# Altium schematic sheet DSP.SchDoc
size B; SheetNumber: 6; SheetTotal: 7
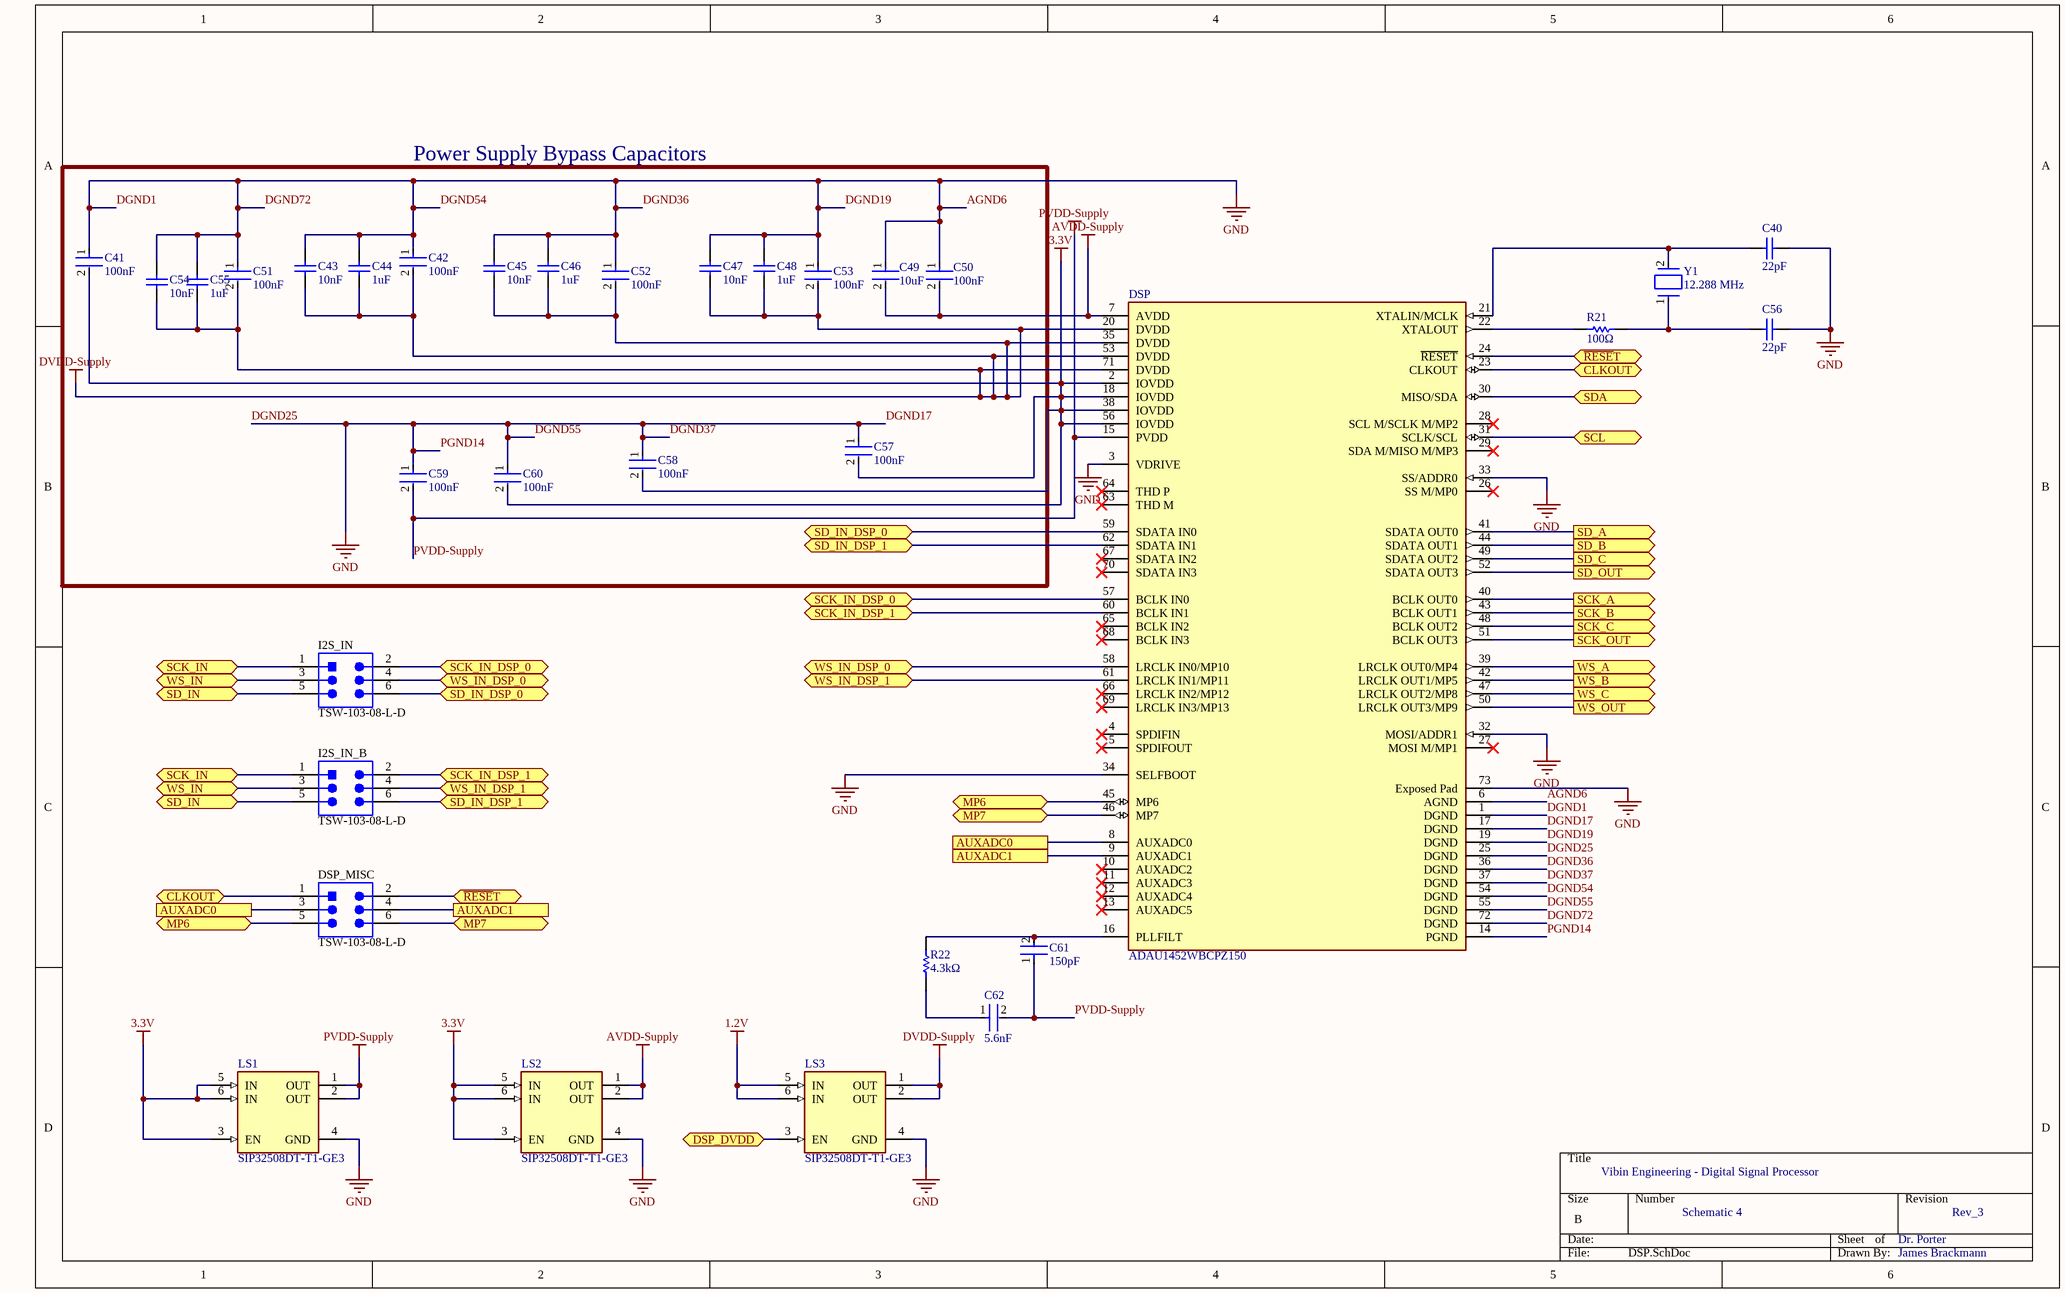
[diagram p0: DSP.SchDoc]

## Parts
C40  22pF  [CAPC1608X90X35ML10T15]
C41  100nF  [FP-C0402-BB-MFG]
C42  100nF  [FP-C0402-BB-MFG]
C43  10nF  [CAPC1005X56X25NL10T15]
C44  1uF  [CAPC2013X145X50LL20T25]
C45  10nF  [CAPC1005X56X25NL10T15]
C46  1uF  [CAPC2013X145X50LL20T25]
C47  10nF  [CAPC1005X56X25NL10T15]
C48  1uF  [CAPC2013X145X50LL20T25]
C49  10uF  [FP-GRM188-0_1-e0_2_0_55-IPC_A]
C50  100nF  [FP-C0402-BB-MFG]
C51  100nF  [FP-C0402-BB-MFG]
C52  100nF  [FP-C0402-BB-MFG]
C53  100nF  [FP-C0402-BB-MFG]
C54  10nF  [CAPC1005X56X25NL10T15]
C55  1uF  [CAPC2013X145X50LL20T25]
C56  22pF  [CAPC1608X90X35ML10T15]
C57  100nF  [FP-C0402-BB-MFG]
C58  100nF  [FP-C0402-BB-MFG]
C59  100nF  [FP-C0402-BB-MFG]
C60  100nF  [FP-C0402-BB-MFG]
C61  150pF  [FP-0805-L_2_01_0_2-W_1_25-IPC_B]
C62  5.6nF  [FP-CL10-IPC_A]
DSP  ADAU1452WBCPZ150  [FP-CP-72-6-IPC_B]
DSP_MISC  TSW-103-08-L-D  [SMTC-TSW-103-08-L-D_V]
I2S_IN  TSW-103-08-L-D  [SMTC-TSW-103-08-L-D_V]
I2S_IN_B  TSW-103-08-L-D  [SMTC-TSW-103-08-L-D_V]
LS1  SIP32508DT-T1-GE3  [FP-E13-1126-IPC_C]
LS2  SIP32508DT-T1-GE3  [FP-E13-1126-IPC_C]
LS3  SIP32508DT-T1-GE3  [FP-E13-1126-IPC_C]
R21  100Ω  [RESC2013X60X40ML20T25]
R22  4.3kΩ  [RESC1005X40X25ML05T10]
Y1  12.288 MHz  [FP-ABM3-MFG]

## Blocks framed on the sheet
Power Supply Bypass Capacitors: C41-C55 C57-C60

## Ports
AUXADC0, AUXADC1, CLKOUT (bidir), DSP_DVDD (bidir), MP6 (bidir), MP7 (bidir), SCK_A (out), SCK_B (out), SCK_C (out), SCK_IN (bidir), SCK_IN_DSP_0 (bidir), SCK_IN_DSP_1 (bidir), SCK_OUT (out), SCL (bidir), SD_A (out), SD_B (out), SD_C (out), SD_IN (bidir), SD_IN_DSP_0 (bidir), SD_IN_DSP_1 (bidir), SD_OUT (out), SDA (bidir), WS_A (out), WS_B (out), WS_C (out), WS_IN (bidir), WS_IN_DSP_0 (bidir), WS_IN_DSP_1 (bidir), WS_OUT (out), ~{RESE}T (bidir)

## Nets
1.2V: LS3.5(IN) LS3.6(IN)
3.3V: C41.2 C57.2 C58.2 C60.2 DSP.2(IOVDD) DSP.18(IOVDD) DSP.38(IOVDD) DSP.56(IOVDD) LS1.3(EN) LS1.5(IN) LS1.6(IN) LS2.3(EN) LS2.5(IN) LS2.6(IN)
AGND6: C40.2 C41.1 C42.1 C43.2 C44.2 C45.2 C46.2 C47.2 C48.2 C49.1 C50.1 C51.1 C52.1 C53.1 C54.2 C55.2 C56.2 C57.1 C58.1 C59.1 C60.1 DSP.1(DGND) DSP.3(VDRIVE) DSP.6(AGND) DSP.14(PGND) DSP.17(DGND) DSP.19(DGND) DSP.25(DGND) DSP.32(MOSI/ADDR1) DSP.33(SS/ADDR0) DSP.34(SELFBOOT) DSP.36(DGND) DSP.37(DGND) DSP.54(DGND) DSP.55(DGND) DSP.72(DGND) DSP.73(Exposed_Pad) LS1.4(GND) LS2.4(GND) LS3.4(GND)  [also labelled DGND1, DGND17, DGND19, DGND25, DGND36, DGND37, DGND54, DGND55, DGND72, GND, PGND14]
AVDD-Supply: C49.2 C50.2 DSP.7(AVDD) LS2.1(OUT) LS2.2(OUT)
DVDD-Supply: C42.2 C43.1 C44.1 C45.1 C46.1 C47.1 C48.1 C51.2 C52.2 C53.2 C54.1 C55.1 DSP.20(DVDD) DSP.35(DVDD) DSP.53(DVDD) DSP.71(DVDD) LS3.1(OUT) LS3.2(OUT)
PVDD-Supply: C59.2 C61.1 C62.2 DSP.15(PVDD) LS1.1(OUT) LS1.2(OUT)
~{RESE}T: DSP.24(~{RESET}) DSP_MISC.2 ; port ~{RESE}T
AUXADC0: DSP.8(AUXADC0) DSP_MISC.3 ; port AUXADC0
AUXADC1: DSP.9(AUXADC1) DSP_MISC.4 ; port AUXADC1
CLKOUT: DSP.23(CLKOUT) DSP_MISC.1 ; port CLKOUT
DSP_DVDD: LS3.3(EN) ; port DSP_DVDD
MP6: DSP.45(MP6) DSP_MISC.5 ; port MP6
MP7: DSP.46(MP7) DSP_MISC.6 ; port MP7
SCK_A: DSP.40(BCLK_OUT0) ; port SCK_A
SCK_B: DSP.43(BCLK_OUT1) ; port SCK_B
SCK_C: DSP.48(BCLK_OUT2) ; port SCK_C
SCK_IN: I2S_IN.1 I2S_IN_B.1 ; port SCK_IN
SCK_IN_DSP_0: DSP.57(BCLK_IN0) I2S_IN.2 ; port SCK_IN_DSP_0
SCK_IN_DSP_1: DSP.60(BCLK_IN1) I2S_IN_B.2 ; port SCK_IN_DSP_1
SCK_OUT: DSP.51(BCLK_OUT3) ; port SCK_OUT
SCL: DSP.31(SCLK/SCL) ; port SCL
SD_A: DSP.41(SDATA_OUT0) ; port SD_A
SD_B: DSP.44(SDATA_OUT1) ; port SD_B
SD_C: DSP.49(SDATA_OUT2) ; port SD_C
SD_IN: I2S_IN.5 I2S_IN_B.5 ; port SD_IN
SD_IN_DSP_0: DSP.59(SDATA_IN0) I2S_IN.6 ; port SD_IN_DSP_0
SD_IN_DSP_1: DSP.62(SDATA_IN1) I2S_IN_B.6 ; port SD_IN_DSP_1
SD_OUT: DSP.52(SDATA_OUT3) ; port SD_OUT
SDA: DSP.30(MISO/SDA) ; port SDA
WS_A: DSP.39(LRCLK_OUT0/MP4) ; port WS_A
WS_B: DSP.42(LRCLK_OUT1/MP5) ; port WS_B
WS_C: DSP.47(LRCLK_OUT2/MP8) ; port WS_C
WS_IN: I2S_IN.3 I2S_IN_B.3 ; port WS_IN
WS_IN_DSP_0: DSP.58(LRCLK_IN0/MP10) I2S_IN.4 ; port WS_IN_DSP_0
WS_IN_DSP_1: DSP.61(LRCLK_IN1/MP11) I2S_IN_B.4 ; port WS_IN_DSP_1
WS_OUT: DSP.50(LRCLK_OUT3/MP9) ; port WS_OUT
NetC40_1: C40.1 DSP.21(XTALIN/MCLK) Y1.2
NetC56_1: C56.1 R21.2 Y1.1
NetC61_2: C61.2 DSP.16(PLLFILT) R22.2
NetC62_1: C62.1 R22.1
NetDSP_22: DSP.22(XTALOUT) R21.1

Not connected (* = marked no-connect by the designer): DSP 4(SPDIFIN)* 5(SPDIFOUT)* 10(AUXADC2)* 11(AUXADC3)* 12(AUXADC4)* 13(AUXADC5)* 26(SS_M/MP0)* 27(MOSI_M/MP1)* 28(SCL_M/SCLK_M/MP2)* 29(SDA_M/MISO_M/MP3)* 63(THD_M)* 64(THD_P)* 65(BCLK_IN2)* 66(LRCLK_IN2/MP12)* 67(SDATA_IN2)* 68(BCLK_IN3)* 69(LRCLK_IN3/MP13)* 70(SDATA_IN3)*

## Notes on the sheet
- Vibin Engineering - Digital Signal Processor
- Schematic 4
- Dr. Porter
- Rev_3
- James Brackmann

## Library data of the parts
C40 C56 = CMP-2000-04945-1: Chip Capacitor, 22 pF, +/- 5%, 50 V, -55 to 125 degC, 0603 (1608 Metric), RoHS, Tape and Reel         GRM1885C1H220JA01D; Manufacturer: Murata; Rated Voltage: 50V; Dielectric: C0G; Capacitance: 22pF; Manufacturer URL: http://www.murata.com/; Datasheet Version: Jul-06; Package Reference: 603; Tolerance (%): ±5%; Case Size/Dimension: 0603; Package Description: 2-Pin Surface Mount Device, Body 1.6 x 0.8 mm; Datasheet URL: https://datasheet.ciiva.com/11786/0900766b807a1cab-11786398.pdf
C41 C42 C50-C53 C57-C60 = CMP-2008-02046-2: CAP CER 0.1UF 10V X5R 0402             C0402C104K8PACTU; Manufacturer: Kemet; Material: Ceramic; Capacitance: 0.10 μF; Temperature Coefficient: 15%; Tolerance: 0.1; Value: 0.10 μF; Package: C0402-BB; Temperature: -55°C to +125°C; ComponentLink2Description: Datasheet; Temperature Characteristic: X5R; Device Class L1: Passive Components; Height: 0.55mm; Lead Free: Yes; ComponentLink2URL: https://content.kemet.com/datasheets/KEM_C1002_X7R_SMD.pdf; Device Class L2: Capacitors; Temperature Range Low: -55°C; Temperature Range High: +125°C; RoHS: TRUE; Octopart: https://octopart.com/c0402c104k8pactu-kemet-140039; Automotive: No; Mouser Description: Capacitor 100 nF 10 VDC 0402; Category: Cap; Voltage Rating: 10 V; Digikey Description: CAP CER 0.1UF 10V X5R 0402; Ipc Land Pattern Name: CAPC10050X50; Device Class L3: Ceramic Capacitors; Manufacturer Part Number: C0402C104K8PACTU
C43 C45 C47 C54 = CMP-2008-02912-1: 0402ZC103KAT2A; Manufacturer: AVX Interconnect / Elco; Part Number: 0402ZC103KAT2A
C44 C46 C48 C55 = CMP-1036-04746-2: C0805C105K4PACTU; Manufacturer: Kemet; Part Number: C0805C105K4PACTU
C49 = CMP-2006-02792-2: Chip Multilayer Ceramic Capacitors for General Purpose, 0603, 10uF, X5R, 15%, 20%, 6.3V         GRM188R60J106ME47D; Packaging: Tape and Reel; Voltage Rating (DC): 6.3V; Width: 0.031inch; Termination: SMD/SMT; Dielectric: X5R; Package Quantity: 4000; Voltage Rating: 6.3V; Capacitance: 10uF; Case/Package: 0603; Min Operating Temperature: -55°C; Voltage: 6.3V; Length: 1.6mm; Thickness: 0.035inch; Lead Free: Lead Free; Depth: 0.8mm; Case Code (Imperial): 0603; Max Operating Temperature: 85°C; Material: Ceramic; Height: 0.8mm; Tolerance: 20%; Mount: Surface Mount; REACH SVHC: No SVHC; Radiation Hardening: No; Case Code (Metric): 1608
C61 = CMP-2007-04584-2: General Purpose Ceramic Capacitor, 0805, 150pF, 5%, C0G, 30ppm/°C, 200V         08052A151JAT2A; Dissipation Factor: 10%; Depth: 1.25mm; Contact Plating: Tin; Number of Pins: 2; Width: 1.25mm; Tolerance: 5%; Mount: Surface Mount; REACH SVHC: No SVHC; Voltage Rating (DC): 200V; Dielectric: C0G; Height: 0.94mm; Max Operating Temperature: 125°C; Package Quantity: 1; Temperature Coefficient: 30ppm/°C; RoHS Compliant: Yes; Series: -; Lead Free: Lead Free; Thickness: 0.037inch; Voltage Rating: 200V; Case Code (Imperial): 0805; Capacitance: 150pF; Min Operating Temperature: -55°C; Radiation Hardening: No; Length: 2.01mm; Construction: Flat; Case/Package: 0805; Packaging: Tape and Reel; Case Code (Metric): 2012; Voltage: 200V; Termination: SMD/SMT
C62 = CMP-13271-003502-1: Cap Ceramic 5.6nF 50V X7R ±10% Pad SMD 0603 +125°C T/R            CL10B562KB8NNNC; Depth: 0.8mm; Radiation Hardening: No; Lead Free: Lead Free; Case/Package: 0603; Case Code (Imperial): 0603; Packaging: Tape and Reel; Case Code (Metric): 1608; Width: 0.031inch; Mount: Surface Mount; Thickness: 0.035inch; Dielectric: X7R; Height: 0.8mm; Voltage Rating (DC): 50V; Length: 1.6mm; Voltage: 50V; Min Operating Temperature: -55°C; Material: Ceramic; Tolerance: 10%; Max Operating Temperature: 125°C; Capacitance: 5.6nF; Voltage Rating: 50V
DSP = CMP-09089-000039-1: 150 MHZ 32BIT SIGMADSP AUDIO PRO; Manufacturer: Analog Devices; RoHS Compliant: Yes; Manufacturer Part Number: ADAU1452WBCPZ150
DSP_MISC I2S_IN I2S_IN_B = CMP-1024-00336-5: Male Header, Pitch 2.54 mm, 2 x 3 Position, Height 8.38 mm, Tail Length 5.08 mm, -55 to 125 degC, RoHS, Bulk; Manufacturer: Samtec; DatasheetVersion: 04/2012; ComponentLink3URL: http://suddendocs.samtec.com/prints/tsw-xxx-xx-x-x-xx-xxx-footprint.pdf; PackageReference: TSW-103-08-L-D; Mounting Technology: Through Hole; Min Operating Temperature: -55 degC; ComponentLink2Description: Datasheet; Lead Pitch: 2.54 mm; ComponentLink1Description: Manufacturer URL; Mount: Through Hole; ComponentLink1URL: http://www.samtec.com/; ComponentLink3Description: Package Specification; Max Operating Temperature: 125 degC; PackageDescription: Male Header, Pitch 2.54 mm, 2 x 3 Position, Height 8.38 mm, Tail Length 5.08 mm; ComponentLink2URL: https://datasheet.ciiva.com/25618/0900766b81154476-25618436.pdf; RoHSCompliant: true
LS1-LS3 = CMP-02501-000001-1: IC PWR SWTCH N-CHAN 1:1 TSOT23-6; Manufacturer: Vishay; Nominal Supply Current: 10.5-105uA; On State Resistance: 44mΩ; Number Of Outputs: 1; Standoff Height: 0mm; Min Supply Voltage: 1.1V; Turn On Delay Time: 1.8ms; Turn Off Delay Time: 0.001ms; Max Power Dissipation: 833mW; Max Junction Temp: +125°C; Max Supply Voltage: 5.5V; Description: VISHAY Power Load Switch, Slew Rate Controlled, High Side, Active High, 1 Output, 5.5V, TSOT-23-6; Device Class L2: Power Management ICs; Octopart: https://octopart.com/sip32508dt-t1-ge3-vishay-29622757; Lead Free: Yes; Package: E13-1126; Height: 1.1mm; Digikey Description: IC PWR SWTCH N-CHAN 1:1 TSOT23-6; Manufacturer Part Number: SIP32508DT-T1-GE3; Device Class L1: Integrated Circuits (ICs); Automotive: No; ComponentLink2URL: http://www.vishay.com/docs/62754/sip32508.pdf; Ipc Land Pattern Name: SOT95P285X100-6; Temperature Range Low: -40°C; Mouser Description: SIP32508 Series 5.5 V 46 mOhm SMT Slew Rate Controlled Load Switch - SOT23-6; RoHS: TRUE; Number Of Channels: 1; Temperature: -40°C to +85°C; Device Class L3: Hot Swap Controllers; Category: IC; Temperature Range High: +85°C; ComponentLink2Description: Datasheet
R21 = CMP-2001-00580-1: ERA6AEB101V; Manufacturer: Panasonic; Part Number: ERA6AEB101V
R22 = CMP-2002-07028-1: RC0402FR-074K3L; Manufacturer: Yageo / Phycomp; Part Number: RC0402FR-074K3L
Y1 = CMP-27762-013601-1: Crystal 12.288MHz ±20ppm 18pF SMD-2 5mm x 3.2mm           ABM3-12.288MHZ-D2Y-T; Series Resistance: 60R; Frequency Stability: 30ppm; Series: ABM3; Frequency: 12.288MHz; Depth: 3.2mm; Package Quantity: 1000; Termination: SMD/SMT; Min Operating Temperature: -40°C; Max Operating Temperature: 85°C; Case/Package: CSMD; Packaging: Tape and Reel; Length: 5mm; Width: 0.126inch; Tolerance: 20ppm; Height: 0.051inch; Number of Pins: 2; Load Capacitance: 18pF; RoHS Compliant: Yes; Resistor Type: Ceramic; Frequency Tolerance: 20ppm; ESR (Equivalent Series Resistance): 60R; Mount: Surface Mount